# EasyEDA Pro project OLEDUI_V1.0.epro

# Schematic Schematic1
Board Name: Board1; Create Date: 2025-10-02; Page Name: P1; Project Name: OLED_UI; Schematic Name: Schematic1; Update Date: 2025-11-09; Company: 嘉立创EDA; Page Size: A4; Version: V1.0
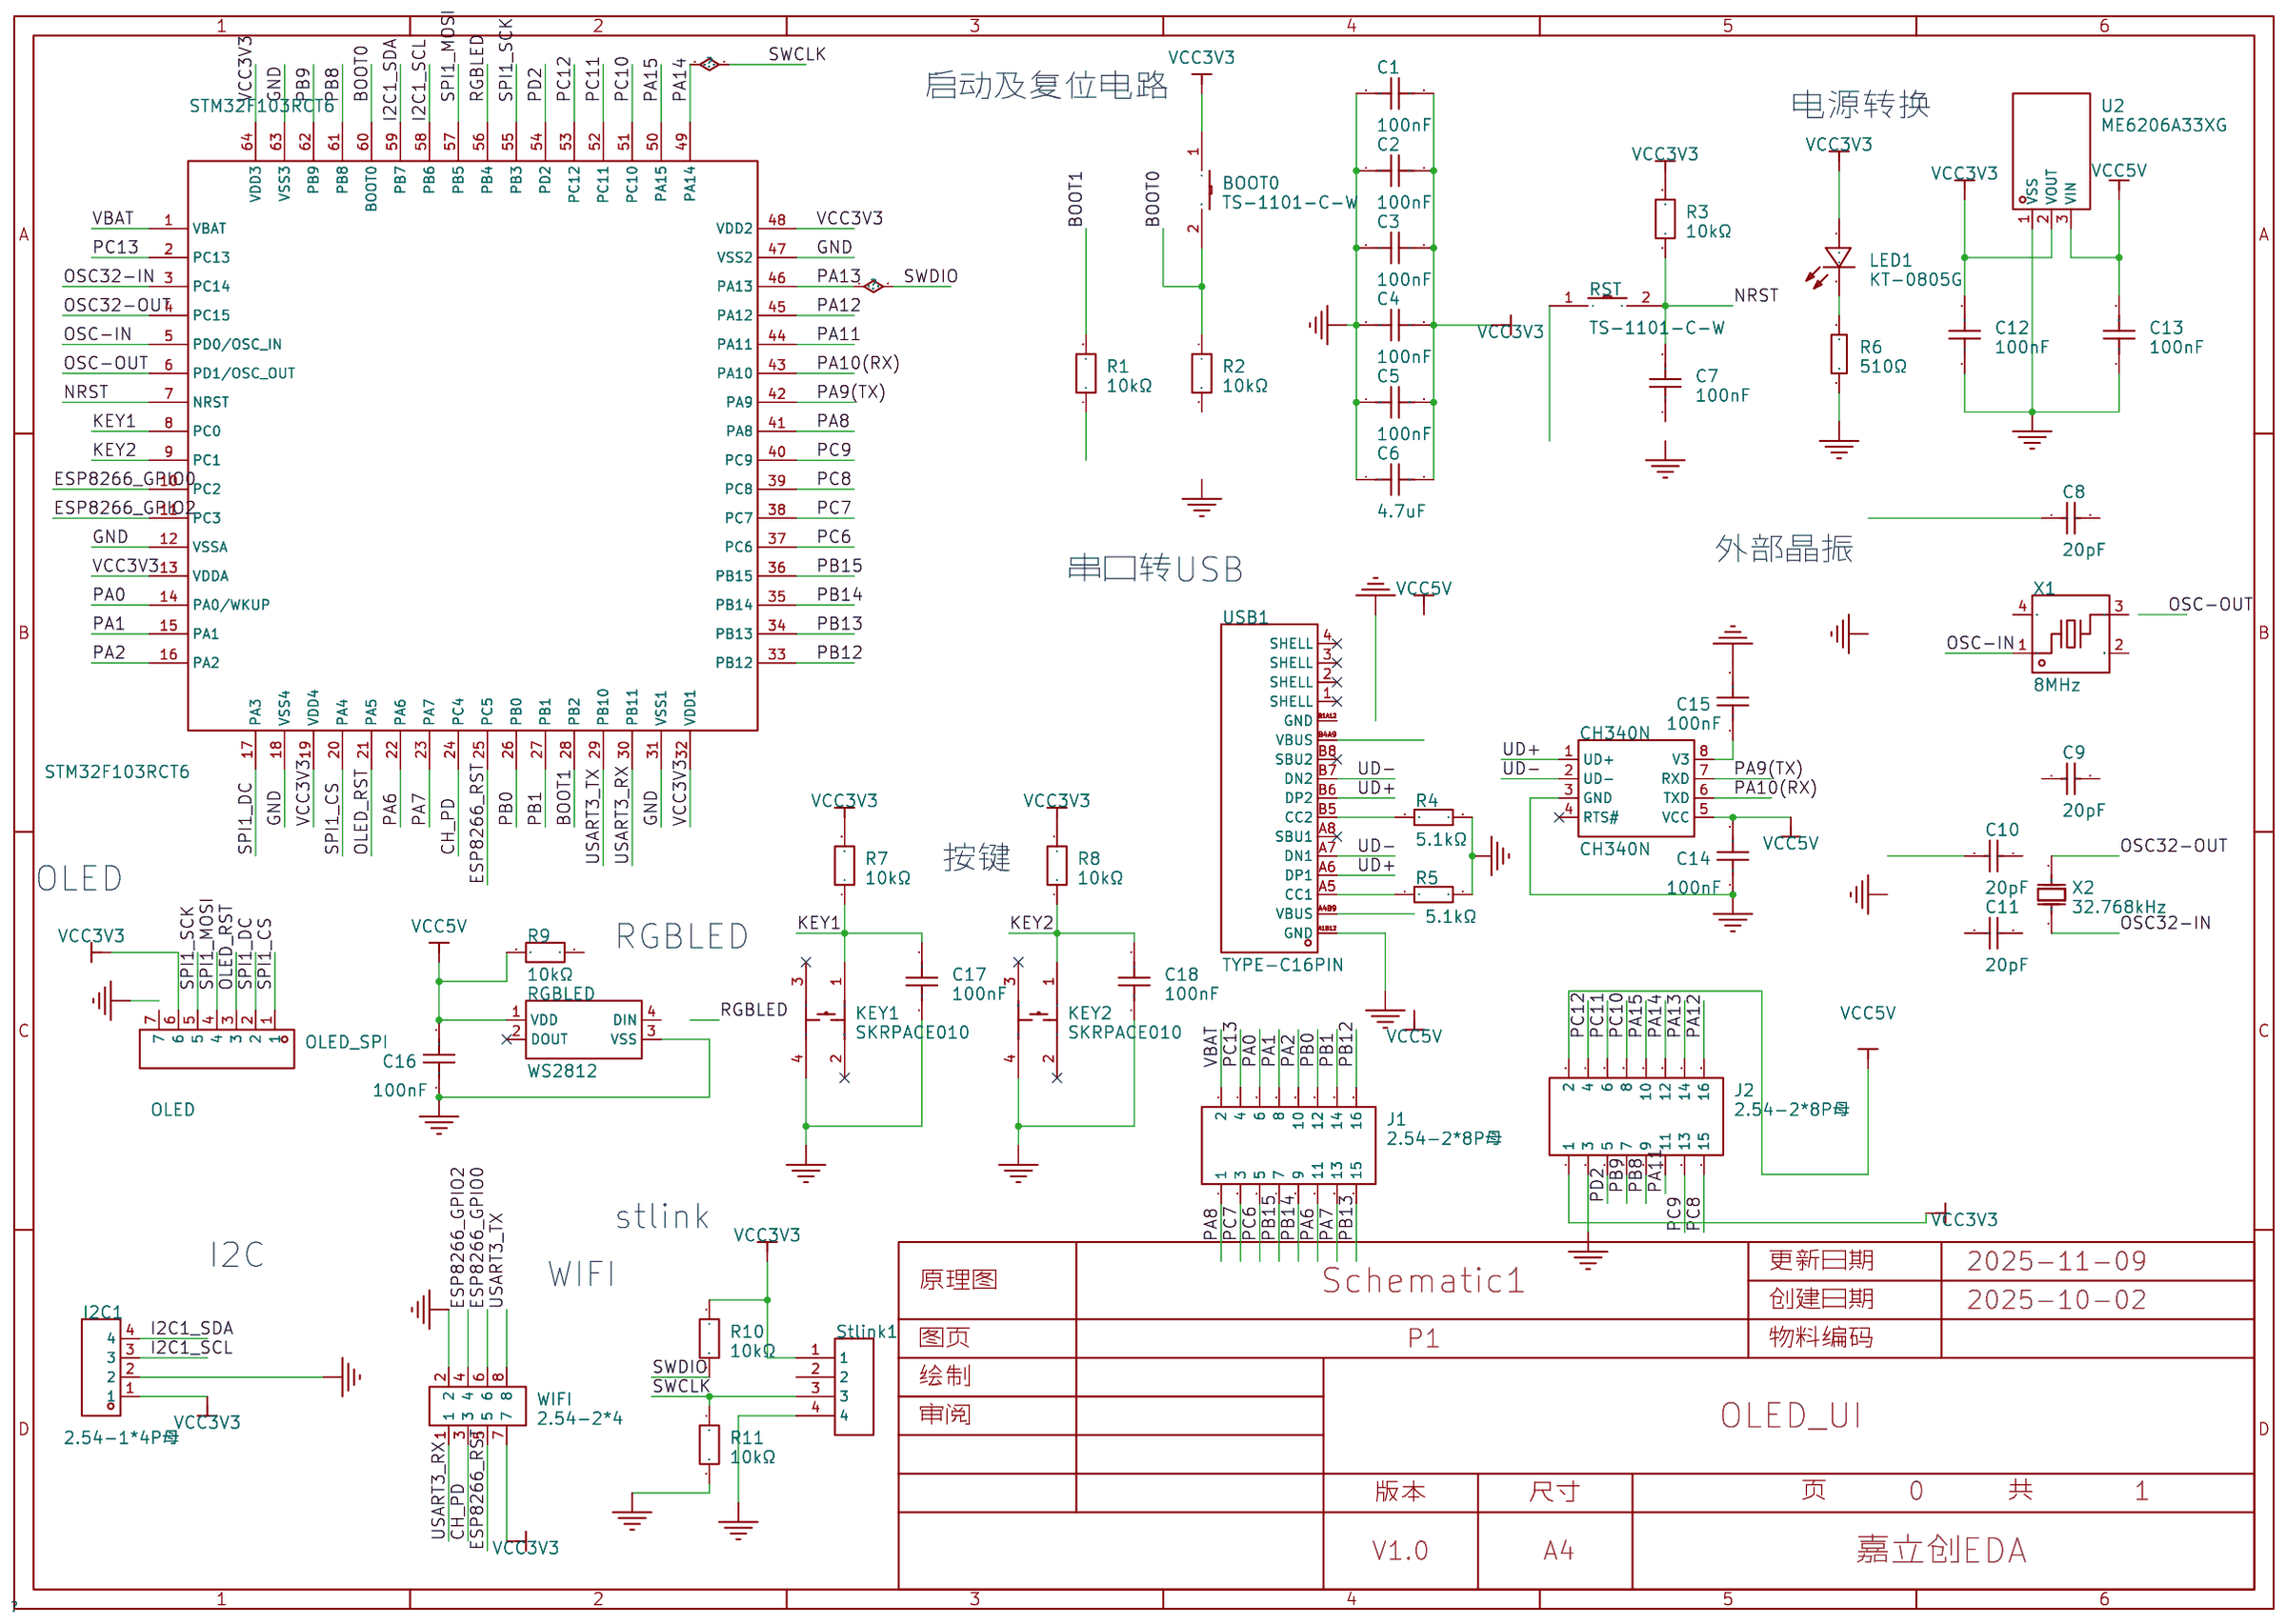
[diagram p0: schematic sheet]

## Parts
BOOT0  TS-1101-C-W  [SW-SMD_L6.0-W3.3-LS8.0]
C1  100nF  [C0603]
C2  100nF  [C0603]
C3  100nF  [C0603]
C4  100nF  [C0603]
C5  100nF  [C0603]
C6  4.7uF  [C0603]
C7  100nF  [C0603]
C8  20pF  [C0603]
C9  20pF  [C0603]
C10  20pF  [C0603]
C11  20pF  [C0603]
C12  100nF  [C0603]
C13  100nF  [C0603]
C14  100nF  [C0603]
C15  100nF  [C0603]
C16  100nF  [C0603]
C17  100nF  [C0603]
C18  100nF  [C0603]
CH340N  CH340N  [SOP-8_L4.9-W3.9-P1.27-LS6.0-BL]
I2C1  2.54-1*4P母  [HDR-TH_4P-P2.54-V-F]
J1  2.54-2*8P母  [HDR-TH_16P-P2.54-V-F-R2-C8-S2.54]
J2  2.54-2*8P母  [HDR-TH_16P-P2.54-V-F-R2-C8-S2.54]
KEY1  SKRPACE010  [KEY-SMD_4P-L4.2-W3.2-P2.20-LS4.6]
KEY2  SKRPACE010  [KEY-SMD_4P-L4.2-W3.2-P2.20-LS4.6]
LED1  KT-0805G  [LED0805-R-RD]
OLED_SPI  OLED  [HDR-TH_7P-P2.54-V-F]
R1  10kΩ  [R0402]
R2  10kΩ  [R0402]
R3  10kΩ  [R0402]
R4  5.1kΩ  [R0805]
R5  5.1kΩ  [R0805]
R6  510Ω  [R0603]
R7  10kΩ  [R0402]
R8  10kΩ  [R0402]
R9  10kΩ  [R0402]
R10  10kΩ  [R0402]
R11  10kΩ  [R0402]
RGBLED  WS2812  [LED-SMD_4P-L5.0-W5.0-TL-A]
RST  TS-1101-C-W  [SW-SMD_L6.0-W3.3-LS8.0]
Stlink1  -  [排针_卧贴_2.54mm_1*4P]
STM32F103RCT6  STM32F103RCT6  [LQFP64]
U2  ME6206A33XG  [SOT-23-3_L2.9-W1.6-P1.90-LS2.8-BR]
USB1  TYPE-C16PIN  [USB-C-SMD_TYPE-C16PIN]
WIFI  2.54-2*4  [HDR-TH_8P-P2.54-V-F-R2-C4-S2.54]
X1  8MHz  [CRYSTAL-SMD_4P-L3.2-W2.5-BL]
X2  32.768kHz  [CRYSTAL-SMD_L3.2-W1.5-1]

## Library data of the parts
BOOT0 RST = TS-1101-C-W: 电路结构:单刀单掷;按钮形状:矩形按钮;作用力:260gf;安装方式:立贴;开关长度:6mm;开关宽度:3.6mm;开关高度:2.5mm;带支架:不带;触点电流:50mA;额定电压(AC):-;额定电压(DC):12V;额定功率:-;绝缘电阻:-;带灯:无;机械寿命:5万次;; LCSC Part Name: 6*3.6*2.5mm 立贴 轻触开关; Supplier Part: C318938; Manufacturer: XKB Connectivity(中国星坤); Supplier Footprint: SMD; JLCPCB Part Class: 扩展库; Datasheet: https://atta.szlcsc.com/upload/public/pdf/source/20200227/C318938_C2E53B1EEDE37D980A33616AC086DE53.pdf; Supplier: LCSC; Circuit: 单刀单掷; Actuator Style: 矩形按钮; Operating Force: 260gf; Mounting Style: 立贴; Switch Length: 6mm; Switch Width: 3.6mm; Switch Height: 2.5mm; Strike Gundam: 不带; Contact Current: 50mA; Voltage Rating (DC): 12V; Actuator/Cap Color: 白色带淡绿; With Lamp: 无; Mechanical Life: 5万次; Operating Temperature: -30℃~+85℃
C1-C5 C7 C12-C18 = CGA0603X7R104K500JT: 容值:100nF;精度:±10%;额定电压:50V;温度系数:X7R;; LCSC Part Name: 100nF ±10% 50V; Supplier Part: C6119867; Manufacturer: HRE(芯声); Supplier Footprint: 0603; JLCPCB Part Class: 扩展库; Datasheet: https://atta.szlcsc.com/upload/public/pdf/source/20250103/C44077DA9E7B3EFAE02F22B6D3D1CBC9.pdf; Supplier: LCSC; Tolerance: ±10%; Voltage Rating: 50V; Temperature Coefficient: X7R
C6 = CL10A475KO8NNNC: 容值:4.7uF;精度:±10%;额定电压:16V;温度系数:X5R;; LCSC Part Name: 4.7uF ±10% 16V; Supplier Part: C19666; Manufacturer: SAMSUNG(三星); Supplier Footprint: 0603; JLCPCB Part Class: 基础库; Datasheet: https://item.szlcsc.com/datasheet/CL10A475KO8NNNC/20375.html; Supplier: LCSC; Tolerance: ±10%; Voltage Rating: 16V; Temperature Coefficient: X5R
C8-C11 = CL10C200JB8NNNC: 容值:20pF;精度:±5%;额定电压:50V;温度系数:C0G;; LCSC Part Name: 20pF ±5% 50V; Supplier Part: C1648; Manufacturer: SAMSUNG(三星); Supplier Footprint: 0603; JLCPCB Part Class: 基础库; Datasheet: https://item.szlcsc.com/datasheet/CL10C200JB8NNNC/2000.html; Supplier: LCSC; Tolerance: ±5%; Voltage Rating: 50V; Temperature Coefficient: C0G
CH340N = CH340N: 应用功能:USB转串口;接口协议:USB 2.0;通道数:1;数据速率:2Mbps;; LCSC Part Name: USB2.0芯片CH340; Supplier Part: C2977777; Manufacturer: WCH(南京沁恒); Supplier Footprint: SOP-8; JLCPCB Part Class: 扩展库; Datasheet: https://atta.szlcsc.com/upload/public/pdf/source/20240313/115CDE92081B1D6CB446704AD5D0F5F2.pdf; Supplier: LCSC; Applications Function: USB转串口; Protocol: USB 2.0; Number of Channels: 1; Voltage - Supply: 3.3V；5V; Data Rate: 2Mbps; Operating Temperature: -20℃~+70℃
I2C1 = 2.54-1*4P母: 插孔结构:1x4P;间距:2.54mm;行距:-;圆孔/方孔:方孔;安装方式:直插;排数:单排;总孔位数:4P;额定电流:3A;额定电压:-;插孔方向:顶部;塑高:-;触头材质:青铜;触头镀层:-;工作温度:-40℃~+105℃;; LCSC Part Name: 间距:2.54mm 1x4P 直插; Supplier Part: C2718488; Manufacturer: BOOMELE(博穆精密); Supplier Footprint: 插件,P=2.54mm; JLCPCB Part Class: 扩展库; Datasheet: https://item.szlcsc.com/datasheet/2.54-1*4P%25E6%25AF%258D/2834502.html; Supplier: LCSC; Holes Structure: 1x4P; Pitch: 2.54mm; Circular Hole / Square Hole: 方孔; Mounting Type: 直插; Number of Rows: 单排; Number of Positions: 4P; Current Rating: 3A; Holes Direction: 顶部; Contact Material: 青铜; Operating Temperature: -40℃~+105℃
J1 J2 = 2.54-2*8P母: 插孔结构:2x8P;间距:2.54mm;行距:2.54mm;安装方式:直插;排数:双排;总孔位数:16P;塑高:-;触头材质:黄铜;触头镀层:-;; LCSC Part Name: 间距:2.54mm 2x8P 直插; Supplier Part: C30734; Manufacturer: BOOMELE(博穆精密); Supplier Footprint: 插件,P=2.54mm; JLCPCB Part Class: 扩展库; Datasheet: https://item.szlcsc.com/datasheet/2.54-2*8P%25E6%25AF%258D/31491.html; Supplier: LCSC; Holes Structure: 2x8P; Pitch: 2.54mm; Row Spacing: 2.54mm; Mounting Type: 直插; Number of Rows: 双排; Number of Positions: 16P; Contact Material: 黄铜
KEY1 KEY2 = SKRPACE010: 电路结构:单刀单掷;按钮形状:椭圆形按钮;安装方式:立贴;开关长度:4.2mm;开关宽度:3.2mm;开关高度:2.5mm;触点电流:50mA;额定电压:16V;带灯:-;工作寿命:-;; LCSC Part Name: 4.2*3.2*2.5mm 立贴 轻触开关; Supplier Part: C139797; Manufacturer: ALPSALPINE(阿尔卑斯阿尔派); Supplier Footprint: SMD; JLCPCB Part Class: 扩展库; Datasheet: https://item.szlcsc.com/datasheet/SKRPACE010/151122.html; Supplier: LCSC; Circuit: 单刀单掷; Actuator Style: 椭圆形按钮; Mounting Type: 立贴; Length: 4.2mm; Width: 3.2mm; Switch Height: 2.5mm; Contact Current: 50mA; Voltage Rating: 16V
LED1 = KT-0805G: 灯头类型:-;发光颜色:翠绿色;正向压降(Vf):2.6V~3.1V;功率:100mW;正向电流:5mA;波长:513nm~528nm;二极管配置:-;透镜颜色:-;色温:-;发光强度:430mcd;发光角度:120°;载带方式:-;工作温度:-40℃~+85℃;; LCSC Part Name: 0805 翠绿 高亮; Supplier Part: C2297; Manufacturer: KENTO; Supplier Footprint: 0805; JLCPCB Part Class: 基础库; Datasheet: https://item.szlcsc.com/datasheet/KT-0805G/2670.html; Supplier: LCSC; Illumination Color: 翠绿色; Voltage - Forward(Vf): 2.6V~3.1V; Power(Watts): 100mW; Forward Current: 5mA; Wavelength - Dominant: 513nm~528nm; Peak Wavelength: 525nm; Luminous Intensity: 430mcd; Viewing Angle: 120°; Operating Temperature: -40℃~+85℃
OLED_SPI = KH-2.54FH-1X7P-H8.5: 插孔结构:1x7P;间距:2.54mm;行距:-;圆孔/方孔:方孔;安装方式:直插;排数:单排;总孔位数:7P;额定电流:3A;额定电压:-;插孔方向:顶部;塑高:8.5mm;工作温度:-40℃~+105℃;; LCSC Part Name: 间距:2.54mm 1x7P 直插; Supplier Part: C2932672; Manufacturer: kinghelm(金航标); Supplier Footprint: 插件,P=2.54mm; JLCPCB Part Class: 扩展库; Datasheet: https://item.szlcsc.com/datasheet/KH-2.54FH-1X7P-H8.5/3278193.html; Supplier: LCSC; Holes Structure: 1x7P; Pitch: 2.54mm; Circular Hole / Square Hole: 方孔; Mounting Type: 直插; Number of Rows: 单排; Number of Positions: 7P; Current Rating: 3A; Holes Direction: 顶部; Insulation Height: 8.5mm; Operating Temperature: -40℃~+105℃
R1-R3 R7-R11 = HP02WAF1002TCE: 电阻类型:厚膜电阻;阻值:10kΩ;精度:±1%;功率:100mW;工作电压:50V;温度系数:±100ppm/℃;; LCSC Part Name: 10kΩ ±1% 100mW 厚膜电阻; Supplier Part: C2759535; Manufacturer: UNI-ROYAL(厚声); Supplier Footprint: 0402; JLCPCB Part Class: 扩展库; Datasheet: https://item.szlcsc.com/datasheet/HP02WAF1002TCE/2878614.html; Supplier: LCSC; Type: 厚膜电阻; Tolerance: ±1%; Power(Watts): 100mW; Voltage-Supply(Max): 50V; Temperature Coefficient: ±100ppm/℃; Operating Temperature: -55℃~+155℃
R4 R5 = 0805W8F5101T5E: 电阻类型:厚膜电阻;阻值:5.1kΩ;精度:±1%;功率:125mW;工作电压:150V;温度系数:±100ppm/℃;; LCSC Part Name: 5.1kΩ ±1% 125mW 厚膜电阻; Supplier Part: C27834; Manufacturer: UNI-ROYAL(厚声); Supplier Footprint: 0805; JLCPCB Part Class: 基础库; Datasheet: https://item.szlcsc.com/datasheet/0805W8F5101T5E/28584.html; Supplier: LCSC; Type: 厚膜电阻; Tolerance: ±1%; Power(Watts): 125mW; Voltage-Supply(Max): 150V; Temperature Coefficient: ±100ppm/℃; Operating Temperature: -55℃~+155℃
R6 = 0603WAF5100T5E: 电阻类型:厚膜电阻;阻值:510Ω;精度:±1%;功率:100mW;工作电压:75V;温度系数:±100ppm/℃;; LCSC Part Name: 510Ω ±1% 100mW 厚膜电阻; Supplier Part: C23193; Manufacturer: UNI-ROYAL(厚声); Supplier Footprint: 0603; JLCPCB Part Class: 基础库; Datasheet: https://item.szlcsc.com/datasheet/0603WAF5100T5E/23920.html; Supplier: LCSC; Type: 厚膜电阻; Tolerance: ±1%; Power(Watts): 100mW; Voltage-Supply(Max): 75V; Temperature Coefficient: ±100ppm/℃; Operating Temperature: -55℃~+155℃
RGBLED = WS2812: RGB三色灯珠，5050RGB集成光源内置IC幻彩灯珠单点单控5V，高性价比，12mA; Supplier Part: C42417498; Manufacturer: worldsemi; Supplier Footprint: SMD5050-4P; JLCPCB Part Class: 扩展库; Datasheet: https://atta.szlcsc.com/upload/public/pdf/source/20241220/DE49FA134DE3BC32DD41246C16D24E19.pdf; Supplier: LCSC
Stlink1 = 排针_卧贴_2.54mm_1*4P
STM32F103RCT6 = STM32F103RCT6: Supplier: LCSC; Manufacturer: STMicroelectronics; image: //image.lceda.cn/szlcsc/C8323.jpg; Supplier Part: C8323; JLCPCB Part Class: Basic
U2 = ME6206A33XG: 输出类型:固定;工作电压:6V;输出电压:3.3V;输出电流:300mA;电源纹波抑制比(PSRR):50dB@(1kHz);输出极性:正极;; LCSC Part Name: 输入6V 输出3.3V 300mA; Supplier Part: C161345; Manufacturer: MICRONE(南京微盟); Supplier Footprint: SOT-23; JLCPCB Part Class: 扩展库; Datasheet: https://item.szlcsc.com/datasheet/ME6206A33XG/172726.html; Supplier: LCSC; Output Type: 固定; Voltage - Supply: 6V; Output Voltage: 3.3V; Output Current: 300mA; Power Supply Rejection Ratio (PSRR): 50dB@(1kHz); Voltage Dropout: 320mV@(200mA); standby current: 6uA; Features: 短路保护；过流保护; Operating Temperature: -25℃~+85℃@(Ta); Output Configuration: 正极; Number of Outputs: 1
USB1 = TYPE-C16PIN: 连接器类型:Type-C;协议标准:USB 3.1;公母:母;安装方式:卧贴;触点数量:16P;端口数量:1;额定电流 - 电源:3A;工作温度:-40℃~+85℃;; LCSC Part Name: Type-C 母 卧贴; Supplier Part: C393939; Manufacturer: SHOU HAN(首韩); Supplier Footprint: SMD; JLCPCB Part Class: 扩展库; Datasheet: https://item.szlcsc.com/datasheet/TYPE-C16PIN/372551.html; Supplier: LCSC; Connector Type: Type-C; Protocol Standard: USB 3.1; Gender: 母; Mounting Type: 卧贴; Number of Contacts: 16P; Number of Ports: 1; Current Rating-Power: 3A; Voltage Rating: 30V; Connect-Disconnect Life: 1万次; Detection color: 黑色; Operating Temperature: -40℃~+85℃
WIFI = 2.54-2*4: 插孔结构:2x4P;间距:2.54mm;行距:2.54mm;圆孔/方孔:方孔;安装方式:直插;排数:双排;总孔位数:8P;额定电流:2.5A;额定电压:-;插孔方向:顶部;塑高:8.5mm;工作温度:-40℃~+105℃;; LCSC Part Name: 间距:2.54mm 2x4P 直插; Supplier Part: C2977588; Manufacturer: ZHOURI(洲日); Supplier Footprint: 插件,P=2.54mm; JLCPCB Part Class: 扩展库; Datasheet: https://item.szlcsc.com/datasheet/2.54-2*4/3388940.html; Supplier: LCSC; Holes Structure: 2x4P; Pitch: 2.54mm; Row Spacing: 2.54mm; Circular Hole / Square Hole: 方孔; Mounting Type: 直插; Number of Rows: 双排; Number of Positions: 8P; Current Rating: 2.5A; Holes Direction: 顶部; Insulation Height: 8.5mm; Operating Temperature: -40℃~+105℃
X1 = X32258MSB4SI: 晶振类型:贴片晶振;频率:8MHz;常温频差:±10ppm;负载电容:20pF;频率稳定度:±20ppm;; LCSC Part Name: YSX321SL 8MHZ 4P 3225 20PF ±10PPM -40~85℃ (±20PPM); Supplier Part: C2682774; Manufacturer: YXC(扬兴晶振); Supplier Footprint: SMD3225-4P; JLCPCB Part Class: 扩展库; Datasheet: https://item.szlcsc.com/datasheet/X32258MSB4SI/2777871.html; Supplier: LCSC; Type: 贴片晶振; Normal temperature Frequency Tolerance: ±10ppm; Load Capacitance: 20pF; Frequency Stability: ±20ppm; Equivalent Series Resistance(ESR): 120Ω; Operating Temperature: -40℃~+85℃
X2 = XKXGI-SUA-32.768K: 晶振类型:贴片晶振;频率:32.768kHz;常温频差:±20ppm;负载电容:12.5pF;频率稳定度:±30ppm;; LCSC Part Name: YST310S 32.768KHZ 2P 3215 12.5PF ±20PPM -40~85℃; Supplier Part: C5213671; Manufacturer: YXC(扬兴晶振); Supplier Footprint: SMD3215-2P; JLCPCB Part Class: 扩展库; Datasheet: https://item.szlcsc.com/datasheet/XKXGI-SUA-32.768K/5908943.html; Supplier: LCSC; Type: 贴片晶振; Normal temperature Frequency Tolerance: ±20ppm; Load Capacitance: 12.5pF; Frequency Stability: ±30ppm; Operating Temperature: -40℃~+85℃

## Nets
GND: C1.1 C2.1 C3.1 C4.1 C5.1 C6.1 C7.1 C8.1 C9.1 C10.1 C11.1 C12.1 C13.1 C14.1 C15.2 C16.1 C17.1 C18.1 CH340N.3(GND) I2C1.2 J2.3 KEY1.4 KEY2.4 OLED_SPI.7 R1.1 R2.2 R4.2 R5.2 R6.1 R11.2 RGBLED.3(VSS) RST.1 Stlink1.4 STM32F103RCT6.12(VSSA) STM32F103RCT6.18(VSS4) STM32F103RCT6.31(VSS1) STM32F103RCT6.47(VSS2) STM32F103RCT6.63(VSS3) U2.1(VSS) USB1.A1B12(GND) USB1.B1A12(GND) WIFI.2 X1.2(GND) X1.4(GND)
VBAT: J1.2 STM32F103RCT6.1(VBAT)
VCC3V3: BOOT0.1 C1.2 C2.2 C3.2 C4.2 C5.2 C6.2 C12.2 I2C1.1 J2.1 LED1.1(A) OLED_SPI.6 R3.1 R7.2 R8.2 R10.1 Stlink1.1 STM32F103RCT6.13(VDDA) STM32F103RCT6.19(VDD4) STM32F103RCT6.32(VDD1) STM32F103RCT6.48(VDD2) STM32F103RCT6.64(VDD3) U2.2(VOUT) WIFI.7
VCC5V: C13.2 C14.2 C16.2 CH340N.5(VCC) J2.2 R9.2 RGBLED.1(VDD) U2.3(VIN) USB1.A4B9(VBUS) USB1.B4A9(VBUS)
BOOT0: BOOT0.2 R2.1 STM32F103RCT6.60(BOOT0)
BOOT1: R1.2 STM32F103RCT6.28(PB2)
CH_PD: STM32F103RCT6.24(PC4) WIFI.3
ESP8266_GPIO0: STM32F103RCT6.10(PC2) WIFI.6
ESP8266_GPIO2: STM32F103RCT6.11(PC3) WIFI.4
ESP8266_RST: STM32F103RCT6.25(PC5) WIFI.5
I2C1_SCL: I2C1.3 STM32F103RCT6.58(PB6)
I2C1_SDA: I2C1.4 STM32F103RCT6.59(PB7)
KEY1: C17.2 KEY1.1 R7.1 STM32F103RCT6.8(PC0)
KEY2: C18.2 KEY2.1 R8.1 STM32F103RCT6.9(PC1)
NRST: C7.2 R3.2 RST.2 STM32F103RCT6.7(NRST)
OLED_RST: OLED_SPI.3 STM32F103RCT6.21(PA5)
OSC32-IN: C11.2 STM32F103RCT6.3(PC14) X2.1(OSC1)
OSC32-OUT: C10.2 STM32F103RCT6.4(PC15) X2.2(OSC2)
OSC-IN: C9.2 STM32F103RCT6.5(PD0/OSC_IN) X1.1
OSC-OUT: C8.2 STM32F103RCT6.6(PD1/OSC_OUT) X1.3
PA0: J1.6 STM32F103RCT6.14(PA0/WKUP)
PA1: J1.8 STM32F103RCT6.15(PA1)
PA2: J1.10 STM32F103RCT6.16(PA2)
PA6: J1.11 STM32F103RCT6.22(PA6)
PA7: J1.13 STM32F103RCT6.23(PA7)
PA8: J1.1 STM32F103RCT6.41(PA8)
PA9(TX): CH340N.7(RXD) STM32F103RCT6.42(PA9)
PA10(RX): CH340N.6(TXD) STM32F103RCT6.43(PA10)
PA11: J2.11 STM32F103RCT6.44(PA11)
PA12: J2.16 STM32F103RCT6.45(PA12)
PA13: J2.14 R10.2 Stlink1.2 STM32F103RCT6.46(PA13)
PA14: J2.12 R11.1 Stlink1.3 STM32F103RCT6.49(PA14)
PA15: J2.10 STM32F103RCT6.50(PA15)
PB0: J1.12 STM32F103RCT6.26(PB0)
PB1: J1.14 STM32F103RCT6.27(PB1)
PB8: J2.9 STM32F103RCT6.61(PB8)
PB9: J2.7 STM32F103RCT6.62(PB9)
PB12: J1.16 STM32F103RCT6.33(PB12)
PB13: J1.15 STM32F103RCT6.34(PB13)
PB14: J1.9 STM32F103RCT6.35(PB14)
PB15: J1.7 STM32F103RCT6.36(PB15)
PC6: J1.5 STM32F103RCT6.37(PC6)
PC7: J1.3 STM32F103RCT6.38(PC7)
PC8: J2.15 STM32F103RCT6.39(PC8)
PC9: J2.13 STM32F103RCT6.40(PC9)
PC10: J2.8 STM32F103RCT6.51(PC10)
PC11: J2.6 STM32F103RCT6.52(PC11)
PC12: J2.4 STM32F103RCT6.53(PC12)
PC13: J1.4 STM32F103RCT6.2(PC13)
PD2: J2.5 STM32F103RCT6.54(PD2)
RGBLED: R9.1 RGBLED.4(DIN) STM32F103RCT6.56(PB4)
SPI1_CS: OLED_SPI.1 STM32F103RCT6.20(PA4)
SPI1_DC: OLED_SPI.2 STM32F103RCT6.17(PA3)
SPI1_MOSI: OLED_SPI.4 STM32F103RCT6.57(PB5)
SPI1_SCK: OLED_SPI.5 STM32F103RCT6.55(PB3)
UD+: CH340N.1(UD+) USB1.A6(DP1) USB1.B6(DP2)
UD-: CH340N.2(UD-) USB1.A7(DN1) USB1.B7(DN2)
USART3_RX: STM32F103RCT6.30(PB11) WIFI.1
USART3_TX: STM32F103RCT6.29(PB10) WIFI.8
$1N4550: C15.1 CH340N.8(V3)
$1N5164: R4.1 USB1.B5(CC2)
$1N5168: R5.1 USB1.A5(CC1)
$1N6741: LED1.2(K) R6.2

Not connected (* = marked no-connect by the designer): CH340N 4(RTS#)*; KEY1 2* 3*; KEY2 2* 3*; RGBLED 2(DOUT)*; USB1 1(SHELL)* 2(SHELL)* 3(SHELL)* 4(SHELL)* A8(SBU1)* B8(SBU2)*

## Notes on the sheet
- 启动及复位电路
- 电源转换
- 串口转USB
- 外部晶振
- 按键
- OLED
- RGBLED
- stlink
- I2C
- WIFI

# Board PCB2
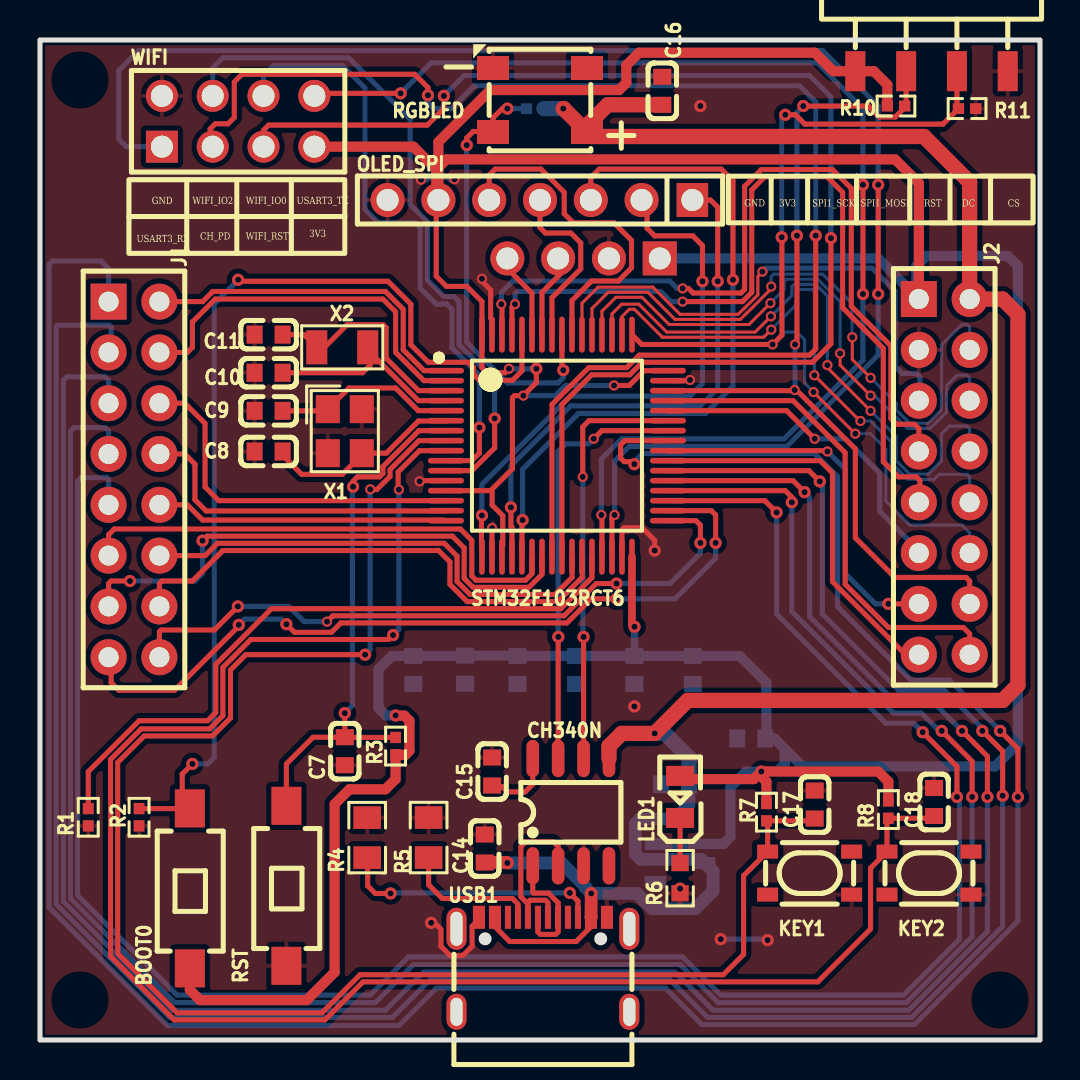
[diagram p1: board, top side]
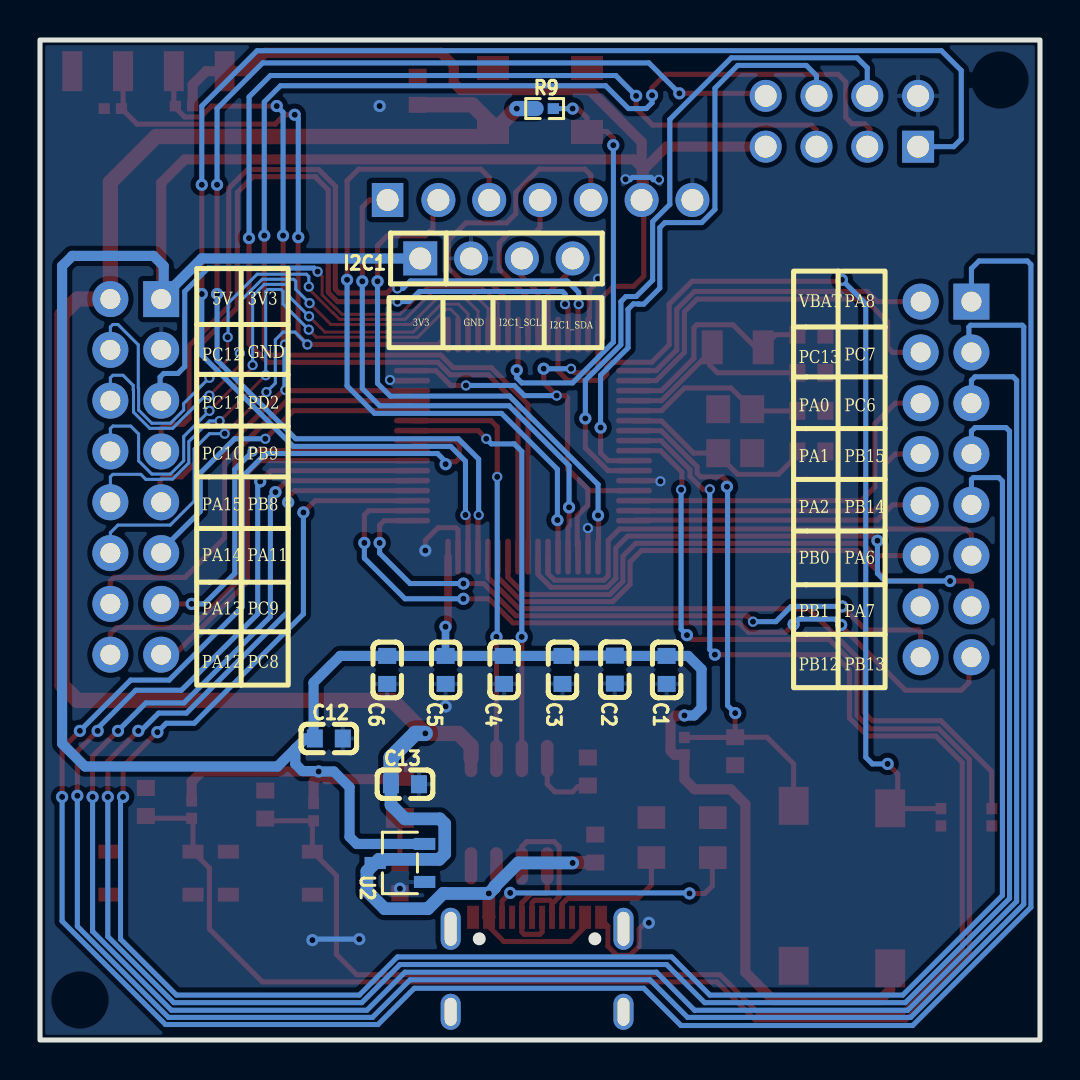
[diagram p2: board, bottom side, seen from below]

Outline 50 x 50 mm; copper layers: Top Layer, Bottom Layer. Coordinates in mm from the lower left corner of the outline.
Outline path: rectangle 0,50 50,0
Stack: Top Layer 0.035mm / Dielectric1 1.51mm FR4 er 4.5 / Bottom Layer 0.035mm

## Design rules (mm)
spacing copperThickness1oz (default): track to track 0.102, other pairs 0.152 to 0.3
spacing copperThickness2oz: track to track 0.203, other pairs 0.152 to 0.3
spacing Plane_innerPlane: track to track 0.102, other pairs 0.152 to 0.3
spacing Copper_copperRegion: track to track 0.102, other pairs 0.152 to 0.3
track width copperThickness1oz (default): min 0.127, default 0.254, max 2.54
track width copperThickness2oz: min 0.203, default 0.254, max 2.54
differential pair differentialPair (default): width min 0.127, default 0.254, max 2.54; gap min 0.152, default 0.152
pour e1222 uses Copper_copperRegion
pour e1313 uses Copper_copperRegion

## Placement (name value [footprint] x y rotation side)
BOOT0  TS-1101-C-W  [SW-SMD_L6.0-W3.3-LS8.0]  7.49 7.58 90 top
C1  100nF  [C0603]  18.67 18.5 90 bottom
C2  100nF  [C0603]  21.26 18.52 90 bottom
C3  100nF  [C0603]  23.88 18.5 90 bottom
C4  100nF  [C0603]  26.8 18.5 90 bottom
C5  100nF  [C0603]  29.72 18.5 90 bottom
C6  4.7uF  [C0603]  32.64 18.5 90 bottom
C7  100nF  [C0603]  15.24 14.44 90 top
C8  20pF  [C0603]  11.43 29.43 0 top
C9  20pF  [C0603]  11.43 31.46 0 top
C10  20pF  [C0603]  11.43 33.36 0 top
C11  20pF  [C0603]  11.43 35.27 0 top
C12  100nF  [C0603]  35.56 15.08 0 bottom
C13  100nF  [C0603]  31.75 12.79 0 bottom
C14  100nF  [C0603]  22.24 9.57 270 top
C15  100nF  [C0603]  22.61 13.42 90 top
C16  100nF  [C0603]  31.12 47.46 270 top
C17  100nF  [C0603]  38.74 11.77 270 top
C18  100nF  [C0603]  44.7 11.9 270 top
CH340N  CH340N  [SOP-8_L4.9-W3.9-P1.27-LS6.0-BL]  26.54 11.39 0 top
I2C1  2.54-1*4P母  [HDR-TH_4P-P2.54-V-F]  27.18 39.08 180 bottom
J1  2.54-2*8P母  [HDR-TH_16P-P2.54-V-F-R2-C8-S2.54]  4.7 28.03 270 top
J2  2.54-2*8P母  [HDR-TH_16P-P2.54-V-F-R2-C8-S2.54]  45.21 28.16 270 top
KEY1  SKRPACE010  [KEY-SMD_4P-L4.2-W3.2-P2.20-LS4.6]  38.48 8.34 0 top
KEY2  SKRPACE010  [KEY-SMD_4P-L4.2-W3.2-P2.20-LS4.6]  44.45 8.34 0 top
LED1  KT-0805G  [LED0805-R-RD]  32 12.15 90 top
OLED_SPI  OLED  [HDR-TH_7P-P2.54-V-F]  25 42 180 top
R1  10kΩ  [R0402]  2.41 11.14 90 top
R2  10kΩ  [R0402]  4.95 11.14 270 top
R3  10kΩ  [R0402]  17.78 14.69 90 top
R4  5.1kΩ  [R0805]  16.36 10.12 90 top
R5  5.1kΩ  [R0805]  19.43 10.12 90 top
R6  510Ω  [R0603]  32 8.09 90 top
R7  10kΩ  [R0402]  36.32 11.39 90 top
R8  10kΩ  [R0402]  42.42 11.52 90 top
R9  10kΩ  [R0402]  24.76 46.57 0 bottom
R10  10kΩ  [R0402]  42.8 46.7 0 top
R11  10kΩ  [R0402]  46.35 46.57 0 top
RGBLED  WS2812  [LED-SMD_4P-L5.0-W5.0-TL-A]  25 47 180 top
RST  TS-1101-C-W  [SW-SMD_L6.0-W3.3-LS8.0]  12.32 7.71 90 top
Stlink1  -  [排针_卧贴_2.54mm_1*4P]  44.58 52.54 0 top
STM32F103RCT6  STM32F103RCT6  [LQFP64]  25.15 24.22 270 top
U2  ME6206A33XG  [SOT-23-3_L2.9-W1.6-P1.90-LS2.8-BR]  32 8.85 180 bottom
USB1  TYPE-C16PIN  [USB-C-SMD_TYPE-C16PIN]  25.15 3.77 0 top
WIFI  2.54-2*4  [HDR-TH_8P-P2.54-V-F-R2-C4-S2.54]  9.91 45.94 0 top
X1  8MHz  [CRYSTAL-SMD_4P-L3.2-W2.5-BL]  15.24 30.44 270 top
X2  32.768kHz  [CRYSTAL-SMD_L3.2-W1.5-1]  15.11 34.63 0 top

## Footprints (pads in the part's own frame, mm; a bottom-side part is the same pattern mirrored in y, then rotated)
C0603
  rect 0.8x0.9 smd: 1(-0.7,0) 2(0.7,0)
CRYSTAL-SMD_4P-L3.2-W2.5-BL
  rect 1.4x1.2 smd: 1(-1.1,-0.85) 2(1.1,-0.85) 3(1.1,0.85) 4(-1.1,0.85)
CRYSTAL-SMD_L3.2-W1.5-1
  rect 1.05x1.7 smd: 1(-1.275,0) 2(1.275,0)
HDR-TH_4P-P2.54-V-F
  rect 1.7x1.7 hole 1.1: 1(-3.81,0)
  round 1.7 hole 1.1: 2(-1.27,0) 3(1.27,0) 4(3.81,0)
HDR-TH_7P-P2.54-V-F
  rect 1.575x1.7 hole 1.1: 1(-7.62,0)
  round 1.7 hole 1.1: 2(-5.08,0) 3(-2.54,0) 4(0,0) 5(2.54,0) 6(5.08,0) 7(7.62,0)
HDR-TH_8P-P2.54-V-F-R2-C4-S2.54
  rect 1.6x1.6 hole 1.1: 1(-3.81,-1.27)
  round 1.6 hole 1.1: 2(-3.81,1.27) 3(-1.27,-1.27) 4(-1.27,1.27) 5(1.27,-1.27) 6(1.27,1.27) 7(3.81,-1.27) 8(3.81,1.27)
HDR-TH_16P-P2.54-V-F-R2-C8-S2.54
  rect 1.8x1.8 hole 1: 1(-8.89,-1.27)
  round 1.8 hole 1: 2(-8.89,1.27) 3(-6.35,-1.27) 4(-6.35,1.27) 5(-3.81,-1.27) 6(-3.81,1.27) 7(-1.27,-1.27) 8(-1.27,1.27) 9(1.27,-1.27) 10(1.27,1.27) 11(3.81,-1.27) 12(3.81,1.27) 13(6.35,-1.27) 14(6.35,1.27) 15(8.89,-1.27) 16(8.89,1.27)
KEY-SMD_4P-L4.2-W3.2-P2.20-LS4.6
  rect 1.05x0.7 smd: 1(-2.1,1.075) 2(2.1,1.075) 3(-2.1,-1.075) 4(2.1,-1.075)
LED0805-R-RD
  rect 1x1.399 smd: 1(1.05,0) 2(-1.05,0)
LED-SMD_4P-L5.0-W5.0-TL-A
  rect 1.6x1.2 smd: 1(-2.35,1.6) 2(-2.35,-1.6) 3(2.35,-1.6) 4(2.35,1.6)
LQFP64
  oval 0.28x1.8 smd: 1(-9.249,-4.848) 2(-8.749,-4.848) 3(-8.249,-4.848) 4(-7.749,-4.848) 5(-7.249,-4.848) 6(-6.749,-4.848) 7(-6.249,-4.848) 8(-5.749,-4.848) 9(-5.249,-4.848) 10(-4.749,-4.848) 11(-4.249,-4.848) 12(-3.749,-4.848) 13(-3.249,-4.848) 14(-2.749,-4.848) 15(-2.249,-4.848) 16(-1.749,-4.848) 33(-1.749,6.252) 34(-2.249,6.252) 35(-2.749,6.252) 36(-3.249,6.252) 37(-3.749,6.252) 38(-4.249,6.252) 39(-4.749,6.252) 40(-5.249,6.252) 41(-5.749,6.252) 42(-6.249,6.252) 43(-6.749,6.252) 44(-7.249,6.252) 45(-7.749,6.252) 46(-8.249,6.252) 47(-8.749,6.252) 48(-9.249,6.252)
  oval 1.8x0.28 smd: 17(0.051,-3.048) 18(0.051,-2.548) 19(0.051,-2.048) 20(0.051,-1.548) 21(0.051,-1.048) 22(0.051,-0.548) 23(0.051,-0.048) 24(0.051,0.452) 25(0.051,0.952) 26(0.051,1.452) 27(0.051,1.952) 28(0.051,2.452) 29(0.051,2.952) 30(0.051,3.452) 31(0.051,3.952) 32(0.051,4.452) 49(-11.049,4.452) 50(-11.049,3.952) 51(-11.049,3.452) 52(-11.049,2.952) 53(-11.049,2.452) 54(-11.049,1.952) 55(-11.049,1.452) 56(-11.049,0.952) 57(-11.049,0.452) 58(-11.049,-0.048) 59(-11.049,-0.548) 60(-11.049,-1.048) 61(-11.049,-1.548) 62(-11.049,-2.048) 63(-11.049,-2.548) 64(-11.049,-3.048)
R0402
  rect 0.566x0.54 smd: 1(-0.433,0) 2(0.433,0)
R0603
  rect 0.806x0.864 smd: 1(-0.753,0) 2(0.753,0)
R0805
  rect 1.133x1.377 smd: 1(-1,0) 2(1,0)
SOP-8_L4.9-W3.9-P1.27-LS6.0-BL
  oval 0.63x1.865 smd: 1(-1.905,-2.683) 2(-0.635,-2.683) 3(0.635,-2.683) 4(1.905,-2.683) 5(1.905,2.683) 6(0.635,2.683) 7(-0.635,2.683) 8(-1.905,2.683)
SOT-23-3_L2.9-W1.6-P1.90-LS2.8-BR
  rect 1.07x0.6 smd: 1(1.235,-0.95) 2(1.235,0.95) 3(-1.235,0)
SW-SMD_L6.0-W3.3-LS8.0
  rect 1.9x1.5 smd: 1(-4,0) 2(4,0)
USB-C-SMD_TYPE-C16PIN
  oval 1x2.1 hole 0.6x1.7: 1(-4.32,1.788) 2(4.32,1.788)
  oval 1x1.8 hole 0.6x1.4: 3(-4.32,-2.362) 4(4.32,-2.362)
  rect 0.6x1.15 smd: A1B12(-3.2,2.362) A4B9(-2.4,2.362) B1A12(3.2,2.362) B4A9(2.4,2.362)
  rect 0.3x1.15 smd: A5(-1.25,2.362) A6(-0.25,2.362) A7(0.25,2.362) A8(1.25,2.362) B5(1.75,2.362) B6(0.75,2.362) B7(-0.75,2.362) B8(-1.75,2.362)
排针_卧贴_2.54mm_1*4P
  rect 1x2 smd: 1(-3.81,-4.1) 2(-1.27,-4.1) 3(1.27,-4.1) 4(3.81,-4.1)

## Nets
As in the schematic.

Pads without a net: CH340N 4; KEY1 2 3; KEY2 2 3; RGBLED 2; USB1 1 2 3 4 A8 B8

## Via types
v1: diameter 0.61, hole 0.305, Top Layer to Bottom Layer, 74 vias
v2: diameter 0.508, hole 0.305, Top Layer to Bottom Layer, 40 vias

## Routing (per net, layer and track width the routed paths; a pad name or vN(x,y) marks a point on that pad's centre or on a via; arc(x,y) is an arc through that point)
GND: length 19.8
  Top Layer w0.254: v2(22.1,38.06) 22.1,37.94 22.53,37.5 22.53,36.1 22.6,36.04 STM32F103RCT6.63 ; v1(30.73,24.47) 30.73,24.98 30.1,25.62 29.21,25.62 29.1,25.5 STM32F103RCT6.31 ; STM32F103RCT6.47 32.47,32.97 v2(32.5,33) ; v2(18.98,27.94) 19.01,27.97 STM32F103RCT6.12 ; STM32F103RCT6.18 22.6,25.59 v2(22.61,25.59) ; v1(19.56,5.86) 19.73,5.86 20.05,5.54 20.05,4.69 20.5,4.23 21.15,4.23 21.6,4.69 21.6,5.69 21.84,5.93 21.84,6.03 USB1.A1B12
  Bottom Layer w0.254: v1(36.38,4.99) 36.33,5.04 v1(34.04,5.04) ; v2(20.72,43.04) 20.7,43.02 20.5,43.02 20.39,43.13 19.45,43.13 19.34,43.02 v2(19.05,43.02)
  vias: v1(29.72,16.68) v1(32,7.57) v1(33.02,46.7)
VBAT: length 17.4
  Top Layer w0.254: J1.2 8.13,36.92 8.64,37.43 17.27,37.43 18.16,36.54 18.16,34.51 19.2,33.47 STM32F103RCT6.1
VCC3V3: length 240
  Top Layer w0.254: STM32F103RCT6.48 30.2,33.47 29.46,32.73 v2(28.7,32.73) ; STM32F103RCT6.19 23.1,24.71 23.14,24.75 23.14,26.21 22.61,26.75 22.61,27.39 22.53,27.47 ; 22.53,27.47 23.62,28.56 23.62,32.12 23.73,32.22 v2(24.17,32.22) 24.82,32.87 v1(24.82,33.56) ; 22.53,27.47 STM32F103RCT6.13 ; OLED_SPI.6 19.81,41.89 19.81,38.19 20.32,37.68 21.34,37.68 22.1,36.92 STM32F103RCT6.64 22.1,33.62 22.35,33.36 23.25,33.36 v2(23.45,33.56)
  Top Layer w0.381: STM32F103RCT6.32 29.6,20.79 v1(29.72,20.66)
  Top Layer w0.508: WIFI.7 18.67,44.67 19.81,43.52 19.81,42.11 OLED_SPI.6 19.92,43.63 ; BOOT0.1 7.49,2.5 8,1.99 13.34,1.99 14.73,3.39 14.73,11.8 15.47,12.53 17.27,12.53 17.78,13.04 R3.1 18.27,14.26 18.47,14.46 18.47,15.96 18.22,16.22 17.79,16.22 v1(17.78,16.23) ; v1(36.07,13.42) 41.91,13.42 42.42,12.92 R8.2 ; v1(36.07,13.42) 36.07,13.17 36.32,12.92 36.32,12.03 ; v1(36.07,13.42) 35.69,13.04 32.17,13.04 LED1.1 ; 19.92,43.63 19.92,44.9 22.52,47.5 28.96,47.5 29.31,47.86 29.31,48.73 29.95,49.36 38.74,49.36 39.66,48.44 Stlink1.1 41.69,48.44 42.37,47.77 R10.1 ; 19.92,43.63 20.32,44.03 42.76,44.03 43.94,42.84 J2.1
  Bottom Layer w0.254: v2(24.17,32.22) 25.78,32.22 26.28,32.73 v2(28.7,32.73) ; v2(23.45,33.56) 24.81,33.56 v1(24.82,33.56)
  Bottom Layer w0.381: v1(29.72,20.66) 29.72,19.21 C5.2
  Bottom Layer w0.508: v1(17.78,16.23) 17.3,16.23 16.92,16.6 16.92,18.54 17.59,19.2 C1.2 21.24,19.2 C2.2 23.86,19.22 C3.2 C4.2 C5.2 C6.2 34.99,19.2 36.32,17.87 36.32,15.14 C12.2 36.72,15.08 37.23,14.57 ; 37.23,14.57 37.23,13.81 36.87,13.45 36.09,13.45 v1(36.07,13.42) 35.31,13.42 34.52,12.64 34.52,10.16 34.16,9.8 U2.2 ; 37.23,14.57 38.12,13.68 47.75,13.68 48.9,14.82 48.9,38.7 48.39,39.2 44.32,39.2 43.81,38.7 43.81,37.17 41.91,39.08 I2C1.1
VCC5V: length 111
  Top Layer w0.254: USB1.B4A9 27.55,5.67 26.81,4.92 23.49,4.92 22.75,5.66 USB1.A4B9
  Top Layer w0.635: v1(23.37,8.85) 23.35,8.87 C14.2 ; v1(27.56,7.33) 27.56,6.15 USB1.B4A9
  Top Layer w0.762: v1(26.16,46.57) 26.18,46.57 RGBLED.1 27.58,45.17 44.2,45.17 46.48,42.89 J2.2 48.13,37.05 48.9,36.28 48.9,17.74 48.13,16.98 32.38,16.98 v1(30.73,15.33) 29.08,15.33 28.45,14.69 CH340N.5 ; C16.2 28.38,46.76 27.43,45.81
  Bottom Layer w0.635: v1(23.37,8.85) 26.09,8.85 27.26,7.67 27.26,7.62 v1(27.56,7.33) 29.84,7.33 30.61,6.57 32.77,6.57 33.66,7.45 33.66,8.44 U2.3 33.06,9.03 30.04,9.03 29.76,9.31 29.76,10.81 30.01,11.06 31.75,11.06 32.45,11.75 C13.2
  Bottom Layer w0.762: C13.2 32.45,14.12 31.24,15.33 v1(30.73,15.33) ; v1(26.16,46.57) R9.2
BOOT0: length 50.4
  Top Layer w0.254: R2.1 7.48,11.57 BOOT0.2 7.11,11.96 7.11,13.3 v1(7.62,13.81) ; STM32F103RCT6.60 24.1,33.46 23.62,32.98 21.97,32.98 21.66,33.29 21.66,33.63 21.41,33.89 19.41,33.89 18.54,34.76 18.54,36.79 17.4,37.94 9.98,37.94 v1(9.91,38.01)
  Bottom Layer w0.254: v1(9.91,38.01) 8.71,36.82 8.71,14.14 8.38,13.81 v1(7.62,13.81)
BOOT1: length 33.5
  Top Layer w0.254: STM32F103RCT6.28 27.6,23.12 26.04,21.56 11.57,21.56 8.79,18.78 8.79,16.37 8.38,15.96 4.96,15.96 2.41,13.42 R1.2
CH_PD: length 69.7
  Top Layer w0.254: WIFI.3 8.51,44.79 8.51,45.56 8.76,45.81 9.4,45.81 9.72,46.13 9.72,47.9 10.1,48.28 18.73,48.28 19.4,47.62 v1(19.4,47.24) ; STM32F103RCT6.24 25.6,31.78 27.44,33.62 29.34,33.62 29.96,34.24 38.48,34.24 38.79,34.55 v1(38.79,40.22)
  Bottom Layer w0.254: v1(19.4,47.24) 19.4,46.86 19.69,46.57 20.57,46.57 21.72,47.71 37.97,47.71 38.79,46.9 v1(38.79,40.22)
ESP8266_GPIO0: length 30.6
  Top Layer w0.254: v1(21.97,30.62) 21.97,29.35 21.59,28.97 STM32F103RCT6.10
  Bottom Layer w0.254: WIFI.6 11.18,48.22 11.68,48.73 15.11,48.73 16.25,47.59 16.25,41.53 16.91,40.87 18.76,40.87 19.01,40.62 19.01,37.59 19.81,36.79 20.07,36.79 20.08,36.8 20.33,36.8 20.6,36.54 20.6,34.61 21.97,33.24 v1(21.97,30.62)
ESP8266_GPIO2: length 34
  Top Layer w0.254: STM32F103RCT6.11 21.59,28.47 22.73,29.61 22.73,30.95
  Bottom Layer w0.254: v1(22.73,31.08) 22.73,32.98 20.96,34.76 20.96,36.92 20.7,37.17 20.19,37.17 19.37,38 19.37,40.92 18.51,41.78 18.51,46.03 15.43,49.11 9.14,49.11 8.64,48.6 WIFI.4
ESP8266_RST: length 65.8
  Top Layer w0.254: STM32F103RCT6.25 26.1,31.78 27.58,33.26 29.48,33.26 30.11,33.89 38.62,33.89 39.55,34.81 v1(39.55,40.09) ; v1(20.19,47.21) 20.19,46.57 19.37,45.75 11.43,45.75 11.18,45.49 WIFI.5
  Bottom Layer w0.254: v1(39.55,40.09) 39.55,47.16 38.48,48.22 21.21,48.22 v1(20.19,47.21)
I2C1_SCL: length 4.7
  Top Layer w0.254: 26.03,39.59 26.03,38.32 25.1,37.38 STM32F103RCT6.58
I2C1_SDA: length 4.6
  Top Layer w0.254: STM32F103RCT6.59 24.6,37.34 23.5,38.44 23.5,39.46
KEY1: length 82.3
  Top Layer w0.254: v1(16.26,19.27) 10.29,19.27 9.53,18.5 9.53,16.1 8.63,15.2 5.21,15.2 3.88,13.88 3.88,4.33 6.86,1.36 14.1,1.36 16,3.26 34.16,3.26 35.18,4.28 35.18,8.22 KEY1.1 36.38,10.9 36.32,10.96 38.62,10.96 C17.2 ; v2(16.51,27.53) 16.52,27.52 16.84,27.52 17.5,28.18 17.5,28.52 18.95,29.97 STM32F103RCT6.8
  Bottom Layer w0.254: v1(16.26,19.27) 16.51,19.52 v2(16.51,27.53)
KEY2: length 88.6
  Top Layer w0.254: STM32F103RCT6.9 18.97,29.47 17.91,28.4 17.91,27.55 v2(17.94,27.52) ; C18.2 44.72,11.19 44.72,11.09 R8.1 42.35,11.02 KEY2.1 41.53,8.6 41.53,5.55 38.89,2.91 16.15,2.91 14.24,1 6.71,1 3.53,4.19 3.53,14.03 5.06,15.56 8.48,15.56 9.14,16.22 9.14,18.63 10.54,20.03 17.44,20.03 v1(17.65,20.24)
  Bottom Layer w0.254: v1(17.65,20.24) 17.94,20.53 v2(17.94,27.52)
NRST: length 27
  Top Layer w0.254: STM32F103RCT6.7 18.94,30.47 17.15,28.67 17.15,28.33 16.97,28.16 15.88,28.16 15.65,27.94 v1(15.65,27.66) ; C7.2 v1(15.24,16.34) ; C7.2 13.65,15.14 12.32,13.81 RST.2 ; C7.2 15.25,15.13 R3.2
  Bottom Layer w0.254: v1(15.24,16.34) 15.62,16.73 15.62,27.63 v1(15.65,27.66)
OLED_RST: length 35.5
  Top Layer w0.254: v1(24.13,26) 24.1,25.97 STM32F103RCT6.21 ; OLED_SPI.3 27.54,43.12 27.97,43.55 34.06,43.55 34.65,42.96 v1(34.65,38.01)
  Bottom Layer w0.254: v1(24.13,26) 24.13,28.54 26.92,31.33 33.27,31.33 34.65,32.7 v1(34.65,38.01)
OSC32-IN: length 11.4
  Top Layer w0.254: STM32F103RCT6.3 18.92,32.47 17.3,34.09 17.3,35.62 17.16,35.76 15.35,35.76 13.97,34.37 13.97,34.12 ; X2.1 13.2,35.27 C11.2
OSC32-OUT: length 10.2
  Top Layer w0.254: 16.51,34.12 16.76,34.12 18.92,31.97 20.3,31.97 STM32F103RCT6.4 ; X2.2 16.51,34.51 16.51,33.74 16.13,33.36 C10.2
OSC-IN: length 9
  Top Layer w0.254: STM32F103RCT6.5 18.91,31.47 17.78,32.6 15.45,32.6 X1.1 14.31,31.46 12.26,31.46
OSC-OUT: length 9.9
  Top Layer w0.254: 12.26,29.43 12.26,29.11 13.08,28.28 15.11,28.28 16.09,29.26 X1.3 17.31,29.34 18.92,30.95 20.28,30.95 STM32F103RCT6.6
PA0: length 18.2
  Top Layer w0.254: STM32F103RCT6.14 8.94,26.97 8.25,27.65 8.25,30.82 7.24,31.84 J1.6
PA1: length 16.6
  Top Layer w0.254: STM32F103RCT6.15 20.28,26.45 8.31,26.45 7.75,27.01 7.75,28.79 7.24,29.3 5.97,29.3
PA2: length 14.5
  Top Layer w0.254: J1.10 7.37,26.76 8.13,26 20.19,26
PA6: length 25.4
  Top Layer w0.254: STM32F103RCT6.22 24.6,23.32 24.27,22.99 21.8,22.99 21.59,23.2 21.59,24.98 21.02,25.55 3.72,25.55 3.43,25.26 J1.11
PA7: length 27.9
  Top Layer w0.254: STM32F103RCT6.23 25.1,23.28 24.45,22.63 21.65,22.63 21.21,23.08 21.21,24.6 20.62,25.19 8.36,25.19 v1(8.13,24.97) ; v1(4.5,22.95) 3.56,22.95 3.43,22.82 J1.13
  Bottom Layer w0.254: v1(8.13,24.97) 8.13,23.33 7.75,22.95 v1(4.5,22.95)
PA8: length 133.4
  Top Layer w0.254: v1(48.9,12.15) 48.9,14.57 v1(48.01,15.46) ; STM32F103RCT6.41 29.24,29.97 29.03,29.75 29.03,29.1 29.21,28.92 29.59,28.92 v1(29.72,28.79)
  Bottom Layer w0.254: v1(48.01,15.46) 45.47,18 43.54,18 39.88,21.66 39.88,28.16 38.72,29.32 30.12,29.32 29.72,28.92 ; v1(48.9,12.15) 48.9,5.94 43.72,0.77 33.1,0.77 31.28,2.59 19.81,2.59 17.95,0.72 6.37,0.72 0.46,6.64 0.46,38.77 0.64,38.95 3.05,38.95 3.43,38.57 J1.1
PA9(TX): length 21.3
  Top Layer w0.254: CH340N.7 25.91,20.15 v1(25.92,20.16) ; v2(27.69,30.06) 28.09,30.47 STM32F103RCT6.42
  Bottom Layer w0.254: v2(27.69,30.06) 27.43,29.81 26.29,29.81 25.91,29.43 25.91,20.16 v1(25.92,20.16)
PA10(RX): length 21
  Top Layer w0.254: CH340N.6 v1(27.18,20.16) ; v2(27.14,28.16) 27.14,30.66 27.45,30.97 STM32F103RCT6.43
  Bottom Layer w0.254: v1(27.18,20.16) 27.14,20.19 v2(27.14,28.16)
PA11: length 16.7
  Top Layer w0.254: STM32F103RCT6.44 37.33,31.47 v2(38.74,30.06)
  Bottom Layer w0.254: J2.11 43.94,24.47 41.99,26.43 41.99,28.34 40.27,30.06 v2(38.74,30.06)
PA12: length 24.8
  Top Layer w0.254: STM32F103RCT6.45 31.4,31.97 37.66,31.97 40.26,29.36 40.26,22.79 42.42,20.63 46.16,20.63 46.48,20.31 J2.16
PA13: length 44.5
  Top Layer w0.254: Stlink1.2 43.31,46.77 R10.2 43.23,46.62 42.76,46.15 41.97,46.15 41.42,46.7 v1(38.16,46.7) ; v1(37.85,40.22) 37.85,34.87 v2(37.75,34.78) ; 37.76,32.47 37.85,32.47 40.77,29.55 40.77,25.11 42.75,23.13 46.3,23.13 46.48,22.95 J2.14 ; 37.76,32.47 STM32F103RCT6.46 ; 37.76,32.47 v2(37.73,32.5)
  Bottom Layer w0.254: 37.73,32.5 37.75,32.52 v2(37.75,34.78) ; v1(37.85,40.22) 37.85,46.38 v1(38.16,46.7)
PA14: length 48.1
  Top Layer w0.152: v2(38.68,32.4) 40.76,30.31 v2(40.77,30.31)
  Top Layer w0.254: Stlink1.3 45.85,46.65 R11.1 45.14,45.79 38.24,45.79 37.77,46.26 v1(37.26,46.26) ; STM32F103RCT6.49 30.09,34.78 v2(36.63,34.78) 37.09,35.24 37.09,40.13 v1(37.09,40.14)
  Bottom Layer w0.152: v2(38.68,32.4) 38.23,32.84 38.23,35.01 37.85,35.39 37.25,35.39 v2(36.63,34.78) ; J2.12 46.48,25.36 46.1,25.74 43.49,25.74 42.29,26.94 42.29,29.55 41.53,30.31 v2(40.77,30.31)
  Bottom Layer w0.254: v1(37.26,46.26) 37.09,46.08 v1(37.09,40.14)
PA15: length 28.6
  Top Layer w0.152: v2(36.56,35.52) 36.19,35.14 31.12,35.14 31.12,35.14 29.72,36.54 29.46,36.54 29.1,36.17 STM32F103RCT6.50 ; 40.89,31.08 40.88,31.08 v2(38.72,33.24)
  Bottom Layer w0.152: v2(41.02,30.95) 41.53,30.95 42.56,29.92 42.56,28.85 43.37,28.04 43.93,28.04 43.94,28.03 44.7,28.03 44.96,28.28 46.35,28.28 46.48,28.16 J2.10 ; v2(38.72,33.24) 38.72,37.42 38.61,37.53 37.95,37.53 37.85,37.43 37.85,36.8 v2(36.56,35.52)
PB0: length 24.1
  Top Layer w0.254: STM32F103RCT6.26 26.61,24.16 26.61,23.14 25.75,22.28 21.5,22.28 20.85,22.93 20.85,24.19 20.21,24.84 8.87,24.84 8.25,24.22 J1.12
PB1: length 26.2
  Top Layer w0.254: J1.14 5.97,22.82 6.1,22.95 7.62,22.95 9.14,24.47 19.8,24.47 19.81,24.48 19.92,24.48 20.5,23.9 20.5,22.78 21.36,21.92 25.9,21.92 27.11,23.14 27.11,24.15 STM32F103RCT6.27
PB8: length 42.3
  Top Layer w0.254: STM32F103RCT6.61 23.6,36.64 v2(23.75,36.79) ; J2.9 43.99,26.94 43.99,27.98 43.81,28.16 42.93,28.16 42.16,28.92 42.16,34.58 40.13,36.61 40.13,42.38 39.34,43.17 36.22,43.17 36.19,43.14 36.19,43.11 35.59,42.51 35.59,37.38 35.12,36.92 v2(32.13,36.92)
  Bottom Layer w0.254: v2(23.75,36.79) 23.75,37.3 23.88,37.43 31.03,37.43 31.54,36.92 v2(32.13,36.92)
PB9: length 41.2
  Top Layer w0.254: v2(23.06,36.79) 23.1,36.76 STM32F103RCT6.62 ; J2.7 43.94,30.57 43.72,30.79 42.84,30.79 42.54,31.08 42.54,34.7 40.56,36.69 40.56,42.58 39.62,43.52 36.07,43.52 35.23,42.69 35.23,37.53 35.05,37.35 32.65,37.35 32.42,37.58 v2(32.13,37.58)
  Bottom Layer w0.254: v2(23.06,36.79) 23.06,37.38 23.64,37.95 31.48,37.95 31.85,37.58 v2(32.13,37.58)
PB12: length 33.6
  Top Layer w0.254: 28.7,22.82 27.81,22.82 26.2,21.21 14.64,21.21 v2(14.35,20.92) ; v1(33.02,24.85) 33.02,25.74 32.79,25.97 STM32F103RCT6.33 ; v1(9.89,21.68) 8.72,20.5 6.06,20.5 5.97,20.41 J1.16
  Bottom Layer w0.254: v1(9.89,21.68) 12.45,21.68 13.21,20.92 v2(14.35,20.92) ; v1(28.83,22.82) 31.5,22.82 33.02,24.35 v1(33.02,24.85)
PB13: length 39.7
  Top Layer w0.254: v1(28.83,22.06) 27.55,22.06 26.35,20.85 15.04,20.85 14.57,20.38 12.72,20.38 v1(12.32,20.79) ; STM32F103RCT6.34 33.56,26.47 33.78,26.25 v1(33.78,24.85) ; J1.15 3.56,19.01 3.56,17.87 3.94,17.49 6.73,17.49 9.94,20.7 v1(9.94,20.76)
  Bottom Layer w0.254: v1(12.32,20.79) 12.06,21.04 10.23,21.04 v1(9.94,20.76) ; v1(33.78,24.85) 33.78,24.09 31.75,22.06 v1(28.83,22.06)
PB14: length 104.1
  Top Layer w0.254: STM32F103RCT6.35 36.24,26.97 v1(36.83,26.38) ; v1(45.85,12.15) 45.85,13.68 v1(44.13,15.39)
  Bottom Layer w0.254: v1(44.13,15.39) 43.69,15.84 42.29,15.84 36.83,21.3 v1(36.83,26.38) ; 45.97,12.15 45.97,5.04 43.18,2.25 34.03,2.25 32.13,4.15 18.41,4.15 16.51,2.25 6.86,2.25 1.88,7.23 1.88,27.94 2.06,28.12 3.34,28.12 3.43,28.03 J1.9
PB15: length 109.6
  Top Layer w0.254: v1(45.09,15.46) 46.61,13.93 v1(46.61,12.15) ; v1(37.59,26.89) 37.59,27.14 37.26,27.47 STM32F103RCT6.36
  Bottom Layer w0.254: 3.43,29.3 3.43,30.44 3.25,30.62 1.7,30.62 1.52,30.44 1.52,7.08 6.74,1.87 16.76,1.87 18.67,3.77 32,3.77 33.91,1.87 43.31,1.87 46.61,5.17 v1(46.61,12.15) ; 37.59,26.76 37.59,21.43 42.68,16.34 44.07,16.34 45.09,15.33
PC6: length 115.2
  Top Layer w0.254: v1(38.23,27.39) 37.65,27.97 STM32F103RCT6.37 ; v1(47.37,12.15) 47.37,14.19 v1(46.1,15.46)
  Bottom Layer w0.254: v1(46.1,15.46) 44.7,16.85 42.8,16.85 38.48,21.17 38.48,27.14 v1(38.23,27.39) ; v1(47.37,12.15) 47.37,5.43 43.43,1.49 33.66,1.49 31.75,3.39 19.18,3.39 17.27,1.49 6.61,1.49 1.17,6.93 1.17,32.98 1.35,33.16 3.25,33.16 3.43,32.98 J1.5
PC7: length 121.4
  Top Layer w0.254: v1(48.13,12.22) 48.13,14.44 v1(47.12,15.46) ; v1(38.99,27.93) 38.45,28.47 STM32F103RCT6.38
  Bottom Layer w0.254: v1(38.99,27.93) 39.09,27.93 39.12,27.91 ; 39.12,27.91 39.12,27.93 ; 39.12,27.91 39.12,21.3 42.93,17.49 45.21,17.49 47.24,15.46 ; v1(48.13,12.22) 48.13,5.69 43.58,1.13 33.38,1.13 31.5,3.01 19.5,3.01 17.62,1.13 6.47,1.13 0.81,6.78 0.81,35.66 0.89,35.74 3.47,35.74 3.56,35.65 3.56,34.51 3.43,34.38
PC8: length 19.7
  Top Layer w0.254: STM32F103RCT6.39 39,28.97 39.62,28.35 39.62,22.92 43.28,19.27 J2.15
PC9: length 18.8
  Top Layer w0.254: v2(39.37,29.43) 39.33,29.47 STM32F103RCT6.40 ; J2.13 v1(42.42,21.81)
  Bottom Layer w0.254: v2(39.37,29.43) 40.26,28.54 40.26,23.33 41.78,21.81 v1(42.42,21.81)
PC10: length 30.7
  Top Layer w0.152: v2(41.53,31.46) 39.37,33.62 v2(39.37,33.74) ; v2(36.55,36.18) 35.76,35.39 31.34,35.39 29.94,36.79 29.08,36.79 28.6,36.31 STM32F103RCT6.51
  Bottom Layer w0.152: v2(39.37,33.74) 39.37,37.2 38.79,37.78 37.7,37.78 37.59,37.67 37.59,37.23 v2(36.55,36.18) ; v2(41.53,31.46) 42.81,30.17 42.81,28.96 43.47,28.3 44.41,28.3 45.07,28.96 45.07,30.3 45.47,30.7 46.35,30.7 46.48,30.57 J2.8
PC11: length 29.2
  Top Layer w0.152: STM32F103RCT6.52 28.1,36.44 28.79,37.14 30.1,37.14 31.46,35.78 35.45,35.78 v2(36.52,36.84) ; v2(40,34.33) 40,33.74 41.4,32.35
  Bottom Layer w0.152: J2.6 46.48,33.11 46.35,33.24 45.85,33.24 45.34,32.73 45.34,32.5 45.32,32.48 45.32,31.39 44.51,30.58 43.37,30.58 41.73,32.22 v2(41.53,32.22) ; 40,34.51 40,36.92 38.89,38.04 37.31,38.04 37.21,37.94 37.21,37.53 v2(36.52,36.84)
PC12: length 32.3
  Top Layer w0.152: v2(36.56,37.67) 36.56,37.56 35.36,36.36 35.34,36.36 35.01,36.03 31.75,36.03 30.39,37.39 28.41,37.39 27.6,36.58 STM32F103RCT6.53 ; 41.4,33.24 40.62,34.02 v2(40.62,35.14)
  Bottom Layer w0.152: v2(40.62,35.14) 40.6,35.16 40.6,36.83 39.14,38.29 36.68,38.29 36.56,38.17 v2(36.56,37.67) ; J2.4 46.48,35.65 46.35,35.78 46.1,35.78 45.09,34.76 45.09,32.6 45.07,32.59 45.07,31.5 44.41,30.84 43.47,30.84 42.81,31.5 42.81,31.82 v2(41.53,33.11)
PC13: length 19.1
  Top Layer w0.254: STM32F103RCT6.2 19.2,32.97 17.78,34.38 17.78,36.41 17.15,37.05 8.76,37.05 7.62,35.9 7.62,34.63 7.37,34.38 5.97,34.38
PD2: length 26.5
  Top Layer w0.152: STM32F103RCT6.54 27.1,36.84 27.9,37.64 30.64,37.64 32,36.28 34.91,36.28 35.24,36.61 35.25,36.61 35.89,37.26 35.89,38.19 v2(36.12,38.42)
  Bottom Layer w0.254: v2(36.12,38.42) 36.3,38.59 41.59,38.59 42.76,37.43 42.76,33.67 43.11,33.33 43.81,33.33 43.99,33.15 43.99,32.02 J2.5
RGBLED: length 22.2
  Top Layer w0.254: v1(26.16,33.49) 26.1,33.55 STM32F103RCT6.56 ; v1(21.34,44.74) 21.34,45.1 21.66,45.43 22.62,45.43 RGBLED.4 22.65,46.11 23.11,46.57 v1(23.37,46.57)
  Bottom Layer w0.254: v1(23.37,46.57) R9.1 ; v1(21.34,44.74) 21.33,44.74 21.33,34.89 23.37,32.86 25.91,32.86 26.16,33.11 v1(26.16,33.49)
SPI1_CS: length 27
  Top Layer w0.254: v1(33.89,37.94) 33.89,41.64 33.53,42 OLED_SPI.1 ; v1(23.55,26.63) 23.55,25.69 23.6,25.64 STM32F103RCT6.20
  Bottom Layer w0.254: v1(33.89,37.94) 33.89,32.58 33.02,31.71 26.54,31.71 23.55,28.72 v1(23.55,26.63)
SPI1_DC: length 28.3
  Top Layer w0.254: v1(22.1,26.23) 22.1,26 22.07,25.97 22.07,24.88 22.1,24.85 STM32F103RCT6.17 ; OLED_SPI.2 30.35,41.73 30.35,40.59 30.73,40.21 32.64,40.21 33.12,39.72 v1(33.12,37.94)
  Bottom Layer w0.254: v1(33.12,37.94) 33.12,32.83 32.49,32.19 26.52,32.19 22.1,27.78 v1(22.1,26.23)
SPI1_MOSI: length 8.9
  Top Layer w0.254: STM32F103RCT6.57 25.6,37.12 27.04,38.56 27.04,39.85 26.54,40.35 25.27,40.35 25,40.62 OLED_SPI.4
SPI1_SCK: length 17.3
  Top Layer w0.254: OLED_SPI.5 22.46,43.25 22.76,43.55 25.05,43.55 26.21,42.39 26.21,41.31 26.67,40.86 28.7,40.86 29.58,39.98 29.58,38.61 28.92,37.95 27.57,37.95 26.6,36.97 STM32F103RCT6.55
UD+: length 6.1
  Top Layer w0.254: USB1.A6 24.89,6.13 24.89,5.41 25.02,5.28 25.78,5.28 25.91,5.41 25.91,6.12 USB1.B6 25.91,6.15 25.91,6.86 25.42,7.34 24.69,7.34 24.64,7.39 CH340N.1
UD-: length 8.6
  Top Layer w0.254: CH340N.2 25.91,9.67 25.65,9.92 24.3,9.92 24.04,9.67 24.04,7.16 24.4,6.81 ; 24.4,6.81 USB1.B7 ; 24.4,6.81 24.4,6.87 24.51,6.99 25.27,6.99 25.4,6.87 USB1.A7
USART3_RX: length 77.9
  Top Layer w0.254: v2(28.73,26.25) 28.6,26.12 28.6,26.03 28.6,26.03 STM32F103RCT6.30 ; v1(41.91,37.3) v1(41.91,42.76)
  Bottom Layer w0.254: WIFI.1 4.32,44.67 3.94,45.05 3.94,48.48 4.93,49.47 39.14,49.47 41.91,46.7 v1(41.91,42.76) ; v2(28.73,26.25) 28.73,28.94 29.46,29.68 37.34,29.68 41.91,34.25 v1(41.91,37.3)
USART3_TX: length 61.7
  Top Layer w0.254: v1(18.03,47.33) 13.84,47.33 WIFI.8 ; v2(28.07,26.25) 28.1,26.22 STM32F103RCT6.29 ; v1(41.15,37.3) v1(41.15,42.76)
  Bottom Layer w0.254: v1(41.15,37.3) 41.15,33.99 37.22,30.06 29.08,30.06 28.07,29.05 v2(28.07,26.25) ; v1(18.03,47.33) 19.56,48.86 38.86,48.86 41.15,46.57 v1(41.15,42.76)
$1N4550: length 3.6
  Top Layer w0.254: CH340N.8 24.64,12.79 24.26,12.41 23.37,12.41 23.11,12.66 22.67,12.66 C15.1
$1N5164: length 13.1
  Top Layer w0.254: v1(17.53,7.33) 16.76,7.33 16.38,7.71 16.38,9.09 R4.1 ; v1(26.49,7.35) 26.9,6.95 USB1.B5
  Bottom Layer w0.254: v1(17.53,7.33) 17.55,7.35 v1(26.49,7.35)
$1N5168: length 6.9
  Top Layer w0.254: 19.56,9.12 19.43,9 19.43,7.76 20.12,7.07 23.62,7.07 23.9,6.8 USB1.A5
$1N6741: length 2.3
  Top Layer w0.254: LED1.2 R6.2

## Copper pours and planes (outline as drawn; the poured copper is in the pictures)
GND on Top Layer: 0,50 50,50 50,0 0,0
GND on Bottom Layer: 0,50 50,50 50,0 0,0

## Text on the board
Bottom Silkscreen Layer: I2C1_SDA | I2C1_SCL | GND | 3V3 | PA8 | PC7 | PC6 | PB15 | PB14 | PA6 | PA7 | PB13 | VBAT | PC13 | PA0 | PA1 | PA2 | PB0 | PB1 | PB12 | PD2 | PB9 | PB8 | PA11 | PC9 | PC8 | 5V | PC12 | PC11 | PC10 | PA15 | PA14 | PA13 | PA12
Top Silkscreen Layer: USART3_RX | GND | WIFI_IO2 | CH_PD | WIFI_IO0 | WIFI_RST | USART3_TX | 3V3 | SPI1_SCK | SPI1_MOSI | RST | DC | CS
